# Altium project DOG_PMU_v2.PrjPcb
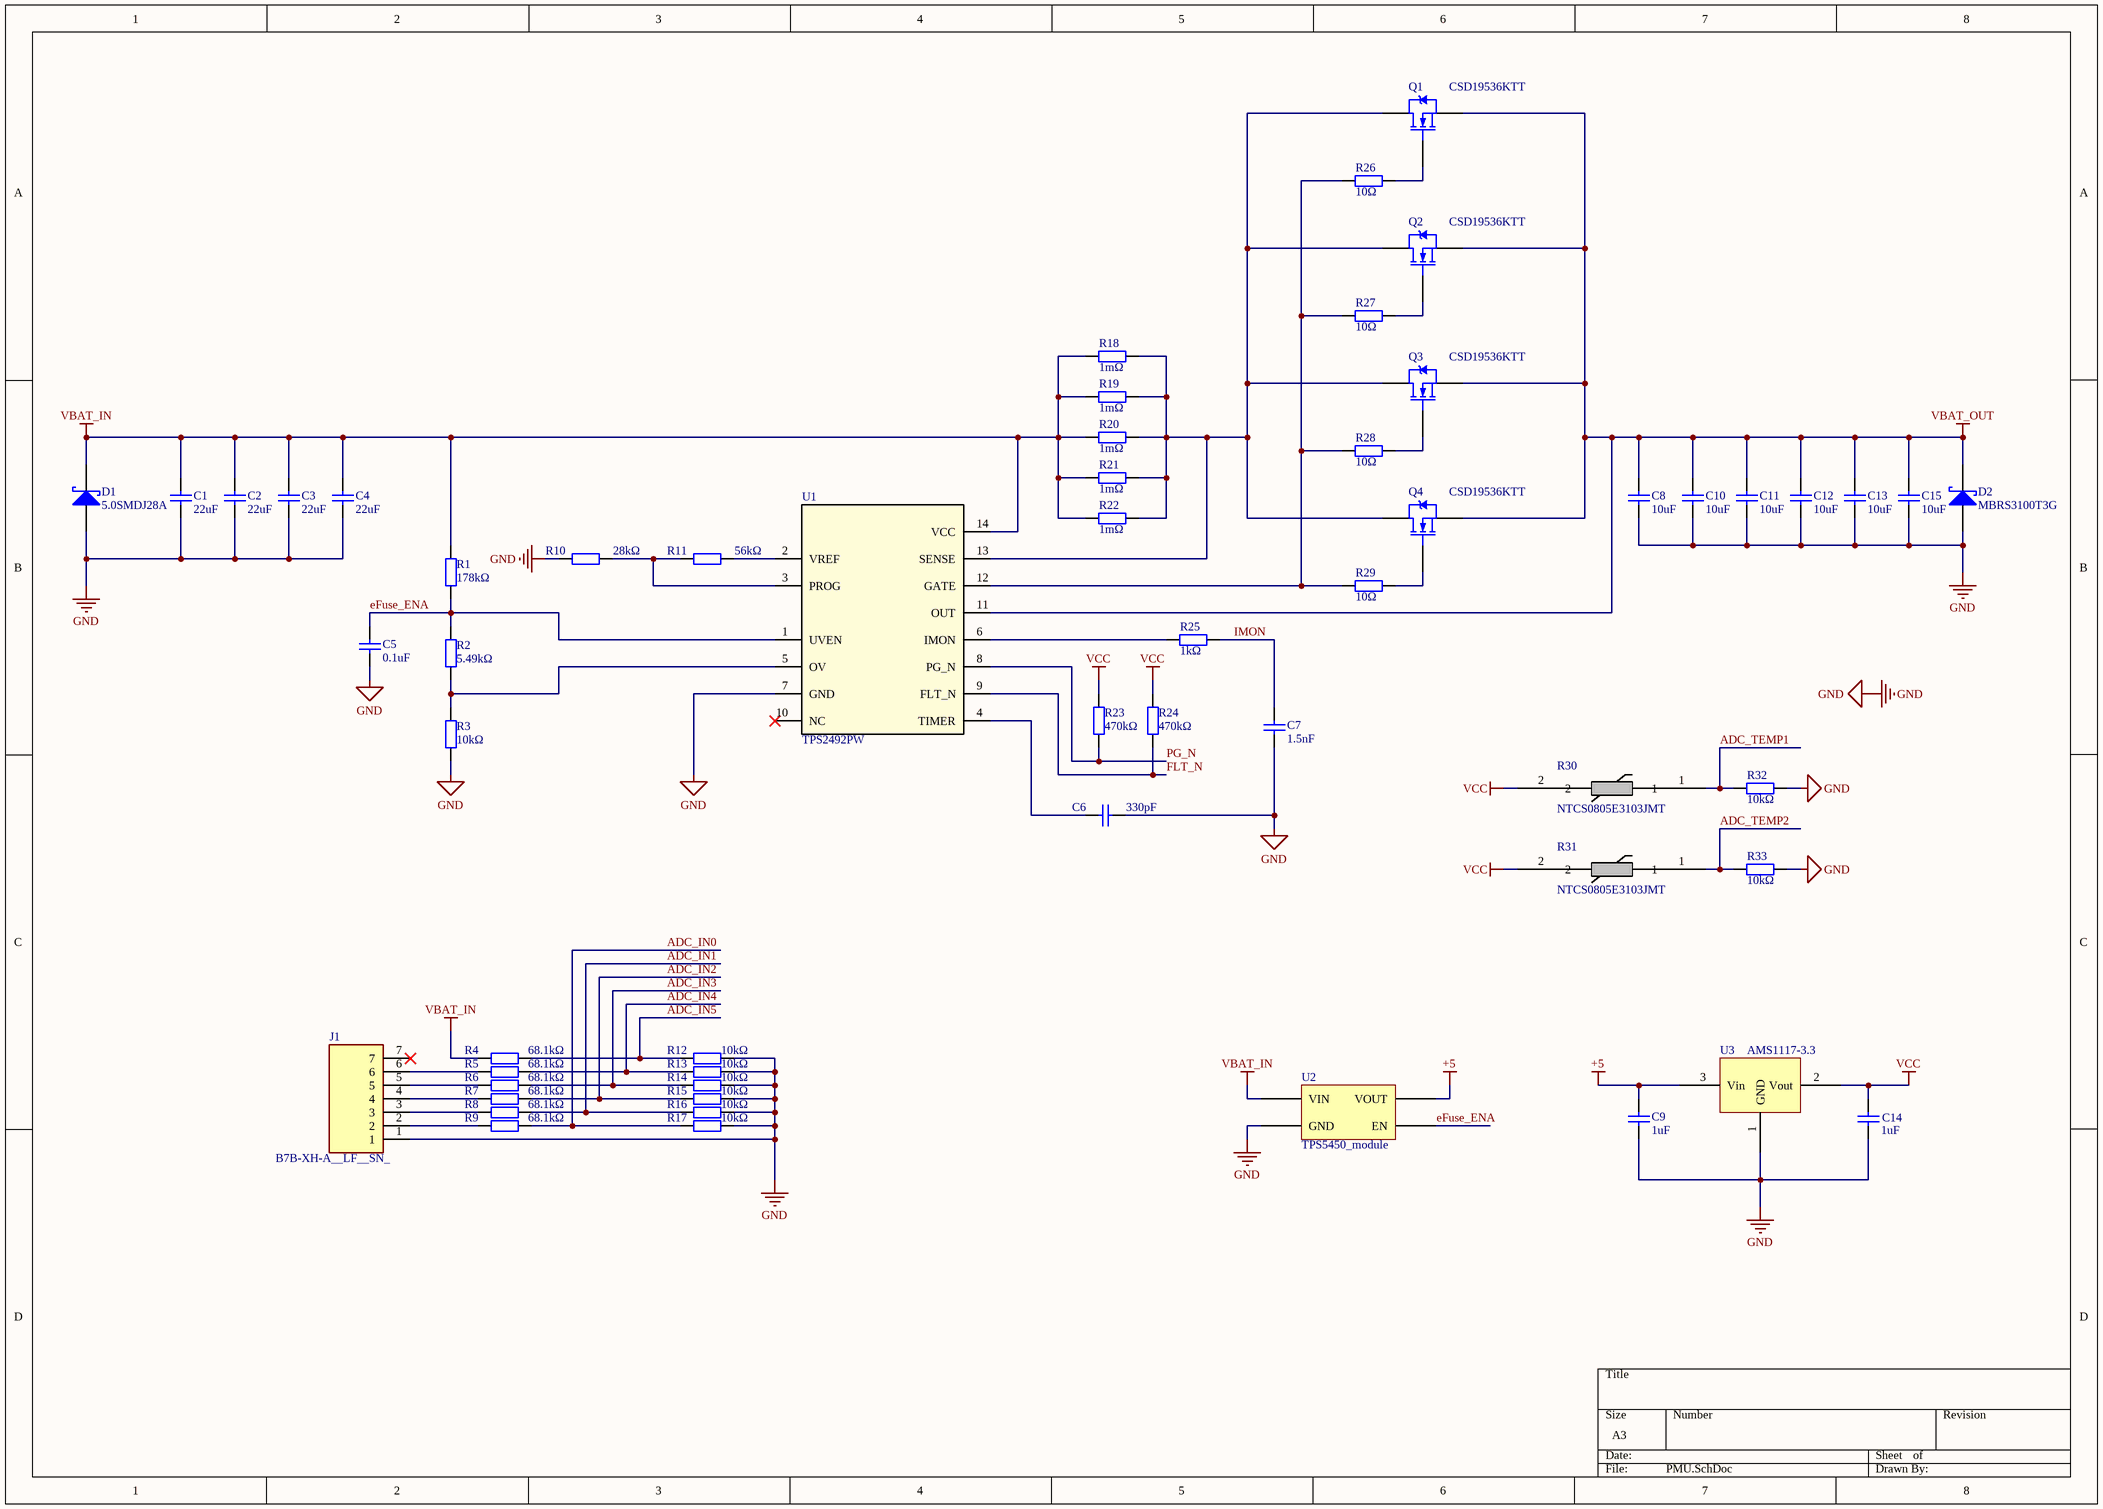
[diagram p0: PMU.SchDoc]
2 sheets, 87 parts. Net scope: global (net labels, ports and power ports of the same name join across sheets).
Board file: PCB.PcbDoc
Sheets:
  PMU.SchDoc
  MCU.SchDoc

## Sheet PMU.SchDoc: 6s Lipo Protection Board
size A3; Author: Yue Wang; CompanyName: UoS; DrawnBy: Yue Wang; Engineer: Yue Wang; Organization: UoS; SheetNumber: 1; SheetTotal: 2

### Parts
C1  22uF  [C1210]
C2  22uF  [C1210]
C3  22uF  [C1210]
C4  22uF  [C1210]
C5  0.1uF  [C0603]
C6  330pF  [C0603]
C7  1.5nF  [C0603]
C8  10uF  [C1210]
C9  1uF  [C0603]
C10  10uF  [C1210]
C11  10uF  [C1210]
C12  10uF  [C1210]
C13  10uF  [C1210]
C14  1uF  [C0603]
C15  10uF  [C1210]
D1  5.0SMDJ28A  [SMA(DO-214AC)]
D2  MBRS3100T3G  [SMA(DO-214AC)]
J1  B7B-XH-A__LF__SN_  [SHDR7W64P0X250_1X7_1990X575X700P]
Q1  CSD19536KTT  [KTT0002A]
Q2  CSD19536KTT  [KTT0002A]
Q3  CSD19536KTT  [KTT0002A]
Q4  CSD19536KTT  [KTT0002A]
R1  178kΩ  [R0603]
R2  5.49kΩ  [R0603]
R3  10kΩ  [R0603]
R4  68.1kΩ  [R0603]
R5  68.1kΩ  [R0603]
R6  68.1kΩ  [R0603]
R7  68.1kΩ  [R0603]
R8  68.1kΩ  [R0603]
R9  68.1kΩ  [R0603]
R10  28kΩ  [R0603]
R11  56kΩ  [R0603]
R12  10kΩ  [R0603]
R13  10kΩ  [R0603]
R14  10kΩ  [R0603]
R15  10kΩ  [R0603]
R16  10kΩ  [R0603]
R17  10kΩ  [R0603]
R18  1mΩ  [2512_R]
R19  1mΩ  [2512_R]
R20  1mΩ  [2512_R]
R21  1mΩ  [2512_R]
R22  1mΩ  [2512_R]
R23  470kΩ  [R0603]
R24  470kΩ  [R0603]
R25  1kΩ  [R0603]
R26  10Ω  [R0603]
R27  10Ω  [R0603]
R28  10Ω  [R0603]
R29  10Ω  [R0603]
R30  NTCS0805E3103JMT  [NTCS0805_VIS]
R31  NTCS0805E3103JMT  [NTCS0805_VIS]
R32  10kΩ  [R0603]
R33  10kΩ  [R0603]
U1  TPS2492PW  [PW0014A_N]
U2  TPS5450_module  [TPS5450_module]
U3  AMS1117-3.3  [SOT-223]

### Nets
+5: C9.2 U2.4(VOUT) U3.3(Vin)
GND: C1.1 C2.1 C3.1 C4.1 C5.1 C6.1 C7.1 C8.1 C9.1 C10.1 C11.1 C12.1 C13.1 C14.1 C15.1 D1.1(A) D2.1(A) J1.1 R3.1 R10.1 R12.1 R13.1 R14.1 R15.1 R16.1 R17.1 R32.2 R33.2 U1.7(GND) U2.2(GND) U3.1(GND)
VBAT_IN: C1.2 C2.2 C3.2 C4.2 D1.2(K) R1.2 R4.2 R18.1 R19.1 R20.1 R21.1 R22.1 U1.14(VCC) U2.1(VIN)
VBAT_OUT: C8.2 C10.2 C11.2 C12.2 C13.2 C15.2 D2.2(K) Q1.3(S) Q2.3(S) Q3.3(S) Q4.3(S) U1.11(OUT)
VCC: C14.2 R23.1 R24.1 R30.2 R31.2 U3.2(Vout)
ADC_IN0: R9.1 R17.2
ADC_IN1: R8.1 R16.2
ADC_IN2: R7.1 R15.2
ADC_IN3: R6.1 R14.2
ADC_IN4: R5.1 R13.2
ADC_IN5: R4.1 R12.2
ADC_TEMP1: R30.1 R32.1
ADC_TEMP2: R31.1 R33.1
eFuse_ENA: C5.2 R1.1 R2.2 U1.1(UVEN) U2.3(EN)
FLT_N: R24.2 U1.9(FLT_N)
IMON: C7.2 R25.1
PG_N: R23.2 U1.8(PG_N)
NetC6_2: C6.2 U1.4(TIMER)
NetJ1_2: J1.2 R9.2
NetJ1_3: J1.3 R8.2
NetJ1_4: J1.4 R7.2
NetJ1_5: J1.5 R6.2
NetJ1_6: J1.6 R5.2
NetQ1_1: Q1.1(G) R26.1
NetQ1_2: Q1.2(D) Q2.2(D) Q3.2(D) Q4.2(D) R18.2 R19.2 R20.2 R21.2 R22.2 U1.13(SENSE)
NetQ2_1: Q2.1(G) R27.1
NetQ3_1: Q3.1(G) R28.1
NetQ4_1: Q4.1(G) R29.1
NetR2_1: R2.1 R3.2 U1.5(OV)
NetR10_2: R10.2 R11.1 U1.3(PROG)
NetR11_2: R11.2 U1.2(VREF)
NetR25_2: R25.2 U1.6(IMON)
NetR26_2: R26.2 R27.2 R28.2 R29.2 U1.12(GATE)

Not connected (* = marked no-connect by the designer): J1 7*; U1 10(NC)*

### Library data of the parts
C1-C4 C8-C15 = Capacitor: VJ1210Y104MXCAT
C5-C7 = Capacitor
D1 = Diode_Schottky: pin to pad: 1>2 2>1
D2 = Diode_Schottky: Schottky Diodes & Rectifiers 3A 100V; pin to pad: 1>2 2>1
J1 = B7B-XH-A__LF__SN_: Connector; Manufacturer_Name: JST (JAPAN SOLDERLESS TERMINALS); Manufacturer_Part_Number: B7B-XH-A (LF)(SN); Datasheet Link: https://www.jst.com/wp-content/uploads/2021/01/eXH-new.pdf; Height: 7mm; Arrow Part Number: B7B-XH-A (LF)(SN); Arrow Price/Stock: https://www.arrow.com/en/products/b7b-xh-a-lf-sn/jst-manufacturing
Q1-Q4 = NMOSFET: 100-V N-Channel NexFET™ Power MOSFET
R1-R17 R23-R29 R32 R33 = Resistor
R18-R22 = Resistor: CHSA2512R0010F
R30 R31 = CMP-02404-000004-2: THERMISTOR NTC 10KOHM 3570K 0805; NexarPartId: 39723061; Power Rating: 210mW; Tolerance: 5%; Resistance: 10kΩ; Accuracy: 3%; Lead Free: Lead Free; Termination: SMD/SMT; Mount: Surface Mount; Max Operating Temperature: 150°C; REACH SVHC: Unknown; Case/Package: 0805; Number of Pins: 2; Radiation Hardening: No; Packaging: Cut Tape (CT); Height: 950µm; Schedule B: 8533400080, 8533400080; Depth: 1.25mm; Length: 2mm; Min Operating Temperature: -40°C; Contact Plating: Tin; RoHS: Compliant; Max Power Dissipation: 210mW; Case Code (Imperial): 0805; Case Code (Metric): 2012
U1 = TPS2492PW: The TPS2492 and TPS2493 are easy-to-use, positive high voltage, 14-pin Hotswap Controllers that safely drive an external N-channel FET to control load current. The programmable power foldback protection ensures that the external FET operates inside its safe operating area (SOA) during overload conditions by controlling of power dissipation. The programmable current limit and fault timer ensure the supply, external FET, and load are not harmed by overcurrent. Features include inrush current limiting, controlled load turn-on, interfacing to down-stream DC-to-DC converters, and power feed protection. / The analog current monitor output provides a signal ready for sampling with an external A/D converter. / Additional features include programmable overvoltage and undervoltage shutdown, power-good for coordinating loads with inrush, and a fault indicator to indicate an over-current shutdown.
U2 = TPS5450_module: https://item.taobao.com/item.htm?id=678523742086&spm=a1z0d.6639537&sku_properties=1627207:1665065280
U3 = AMS1117-3.3: C347222

## Sheet MCU.SchDoc
size A4; SheetNumber: 2; SheetTotal: 2
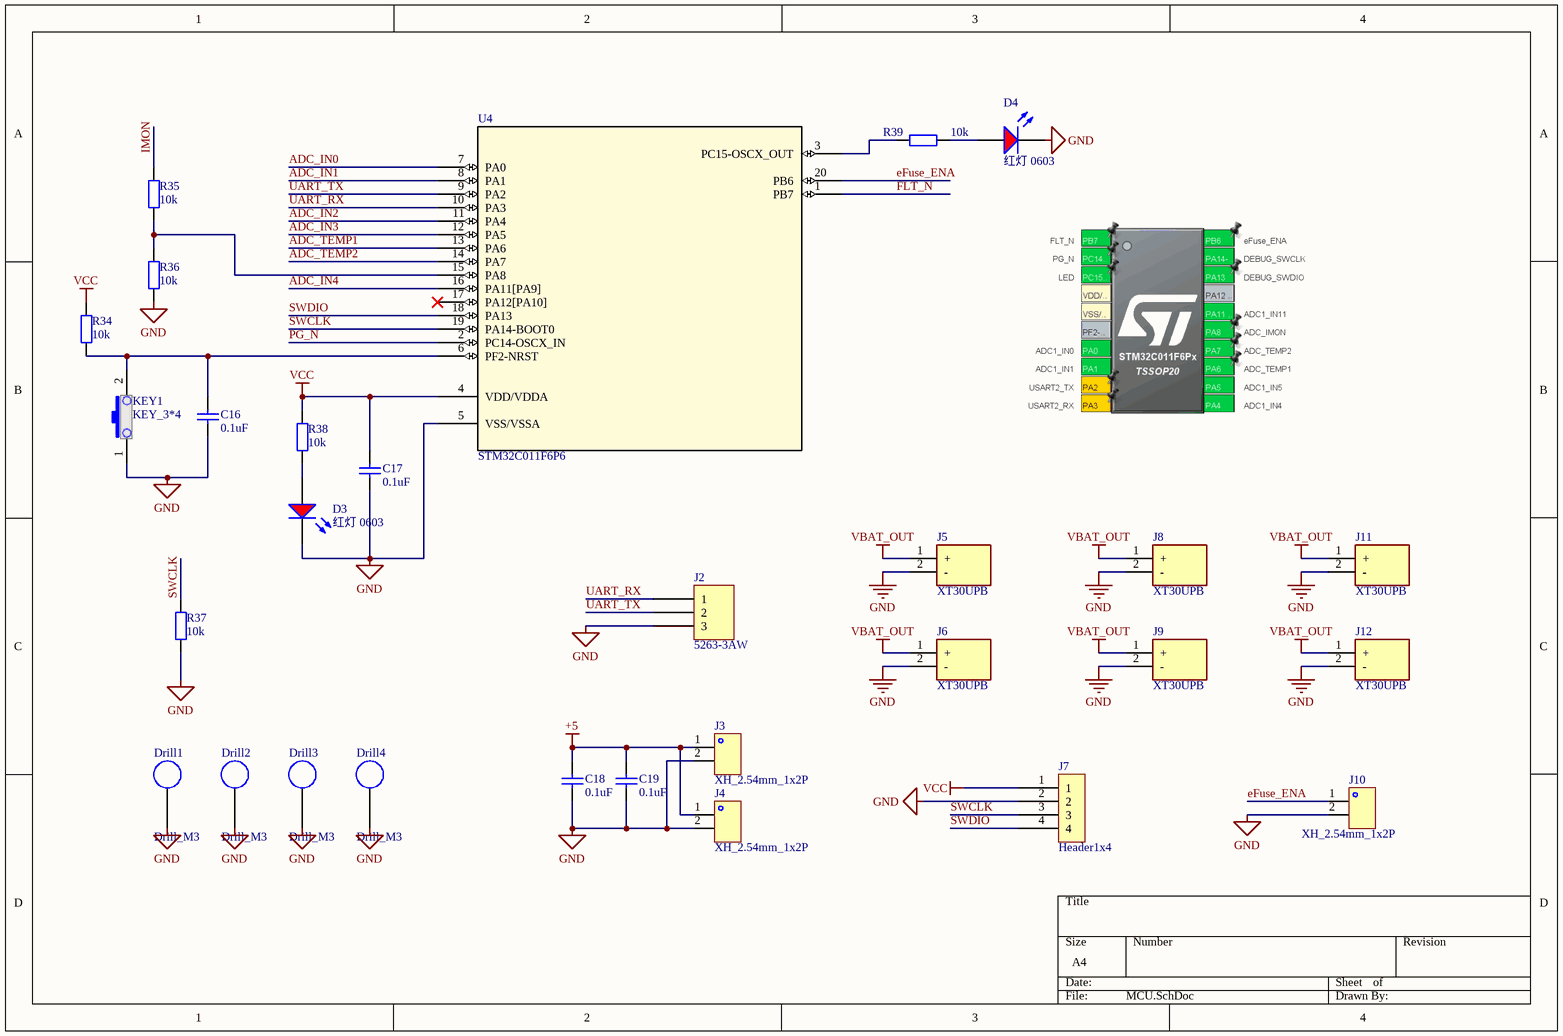
[diagram p1: MCU.SchDoc]

### Parts
C16  0.1uF  [C0603]
C17  0.1uF  [C0603]
C18  0.1uF  [C0603]
C19  0.1uF  [C0603]
D3  红灯 0603  [0603_LED_S1]
D4  红灯 0603  [0603_LED_S1]
Drill1  Drill_M3  [Drill_M_3]
Drill2  Drill_M3  [Drill_M_3]
Drill3  Drill_M3  [Drill_M_3]
Drill4  Drill_M3  [Drill_M_3]
J2  5263-3AW  [5264-3AW]
J3  XH_2.54mm_1x2P  [XH2.54mm1x2P弯插]
J4  XH_2.54mm_1x2P  [XH2.54mm1x2P弯插]
J5  XT30UPB  [XT30UPB]
J6  XT30UPB  [XT30UPB]
J7  Header1x4  [Header 1x4p]
J8  XT30UPB  [XT30UPB]
J9  XT30UPB  [XT30UPB]
J10  XH_2.54mm_1x2P  [XH2.54mm1x2P弯插]
J11  XT30UPB  [XT30UPB]
J12  XT30UPB  [XT30UPB]
KEY1  KEY_3*4  [KEY_3*4]
R34  10k  [R0603]
R35  10k  [R0603]
R36  10k  [R0603]
R37  10k  [R0603]
R38  10k  [R0603]
R39  10k  [R0603]
U4  STM32C011F6P6  [TSSOP20_STM]

### Nets
+5: C18.1 C19.1 J3.1 J4.1
GND: C16.1 C17.1 C18.2 C19.2 D3.K D4.K Drill1.0(A) Drill2.0(A) Drill3.0(A) Drill4.0(A) J2.3 J3.2 J4.2 J5.2(-) J6.2(-) J7.2 J8.2(-) J9.2(-) J10.2 J11.2(-) J12.2(-) KEY1.1 R36.1 R37.1 U4.5(VSS/VSSA)
VBAT_OUT: J5.1(+) J6.1(+) J8.1(+) J9.1(+) J11.1(+) J12.1(+)
VCC: C17.2 J7.1 R34.2 R38.1 U4.4(VDD/VDDA)
ADC_IN0: U4.7(PA0)
ADC_IN1: U4.8(PA1)
ADC_IN2: U4.11(PA4)
ADC_IN3: U4.12(PA5)
ADC_IN4: U4.16(PA11[PA9])
ADC_TEMP1: U4.13(PA6)
ADC_TEMP2: U4.14(PA7)
eFuse_ENA: J10.1 U4.20(PB6)
FLT_N: U4.1(PB7)
IMON: R35.2
PG_N: U4.2(PC14-OSCX_IN)
SWCLK: J7.3 R37.2 U4.19(PA14-BOOT0)
SWDIO: J7.4 U4.18(PA13)
UART_RX: J2.1 U4.10(PA3)
UART_TX: J2.2 U4.9(PA2)
NetC16_2: C16.2 KEY1.2 R34.1 U4.6(PF2-NRST)
NetD3_A: D3.A R38.2
NetD4_A: D4.A R39.2
NetR35_1: R35.1 R36.2 U4.15(PA8)
NetR39_1: R39.1 U4.3(PC15-OSCX_OUT)

Not connected (* = marked no-connect by the designer): U4 17(PA12[PA10])*

### Library data of the parts
C16-C19 = Capacitor
D3 D4 = 0603 红灯: 发光二极管; ComponentLink1Description: 供应商链接; ComponentLink1URL: http://www.szlcsc.com/product/details_2659.html; Package: 0603; Supplier: LC; SuppliersPartNumber: C2286
J5 J6 J8 J9 J11 J12 = XT30UPB: https://item.taobao.com/item.htm?abbucket=12&id=607162270928&ns=1&priceTId=2147810917158194959275132&sku_properties=1627207:45770027
KEY1 = KEY_3*4: C707339
R34-R39 = Resistor
U4 = STM32C011F6P6: No Description Available; Mfr_Name: STMicroelectronics; Copyright: Copyright (C) 2024 Ultra Librarian. All rights reserved.; Manufacturer_Part_Number: STM32C011F6P6; RefDes: RefDes; Type: DEV

## Nets that join several sheets
+5: PMU (C9.2 U2.4 U3.3), MCU (C18.1 C19.1 J3.1 J4.1)
GND: PMU (31 pins), MCU (25 pins)
VBAT_OUT: PMU (12 pins), MCU (6 pins)
VCC: PMU (6 pins), MCU (5 pins)
ADC_IN0: PMU (R9.1 R17.2), MCU (U4.7)
ADC_IN1: PMU (R8.1 R16.2), MCU (U4.8)
ADC_IN2: PMU (R7.1 R15.2), MCU (U4.11)
ADC_IN3: PMU (R6.1 R14.2), MCU (U4.12)
ADC_IN4: PMU (R5.1 R13.2), MCU (U4.16)
ADC_TEMP1: PMU (R30.1 R32.1), MCU (U4.13)
ADC_TEMP2: PMU (R31.1 R33.1), MCU (U4.14)
eFuse_ENA: PMU (5 pins), MCU (J10.1 U4.20)
FLT_N: PMU (R24.2 U1.9), MCU (U4.1)
IMON: PMU (C7.2 R25.1), MCU (R35.2)
PG_N: PMU (R23.2 U1.8), MCU (U4.2)